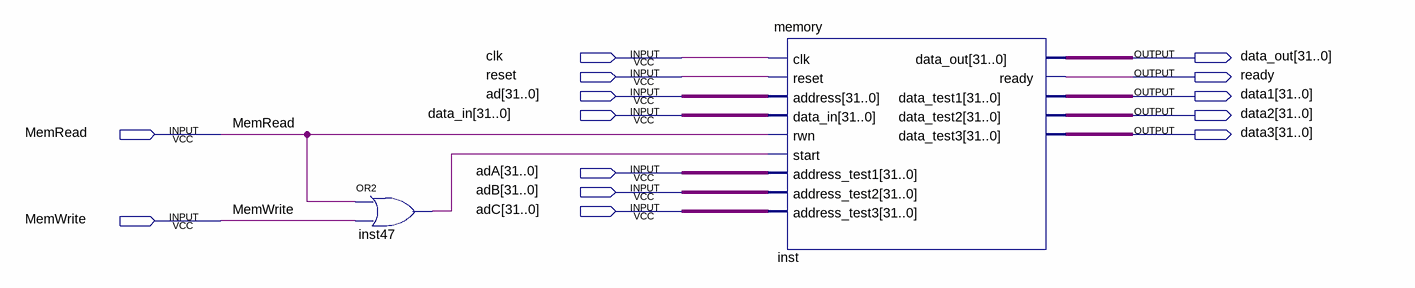
[diagram p0: schematic sheet]
// Quartus schematic MemTest2.bdf as structural Verilog: 2 symbols, 14 pins
module MemTest2 (
  input  clk,
  input  reset,
  input  [31:0] ad,
  input  [31:0] data_in,
  input  MemRead,
  input  [31:0] adA,
  input  [31:0] adB,
  input  [31:0] adC,
  input  MemWrite,
  output [31:0] data_out,
  output ready,
  output [31:0] data1,
  output [31:0] data2,
  output [31:0] data3
);

  wire inst47_out;

  or inst47 (inst47_out, MemRead, MemWrite);
  memory inst (
    .clk(clk), .reset(reset), .address(ad), .data_in(data_in), .rwn(MemRead), .start(inst47_out),
    .address_test1(adA), .address_test2(adB), .address_test3(adC), .data_out(data_out), .ready(ready),
    .data_test1(data1), .data_test2(data2), .data_test3(data3));
endmodule
